# Altium project NodeSensor.PrjPcb
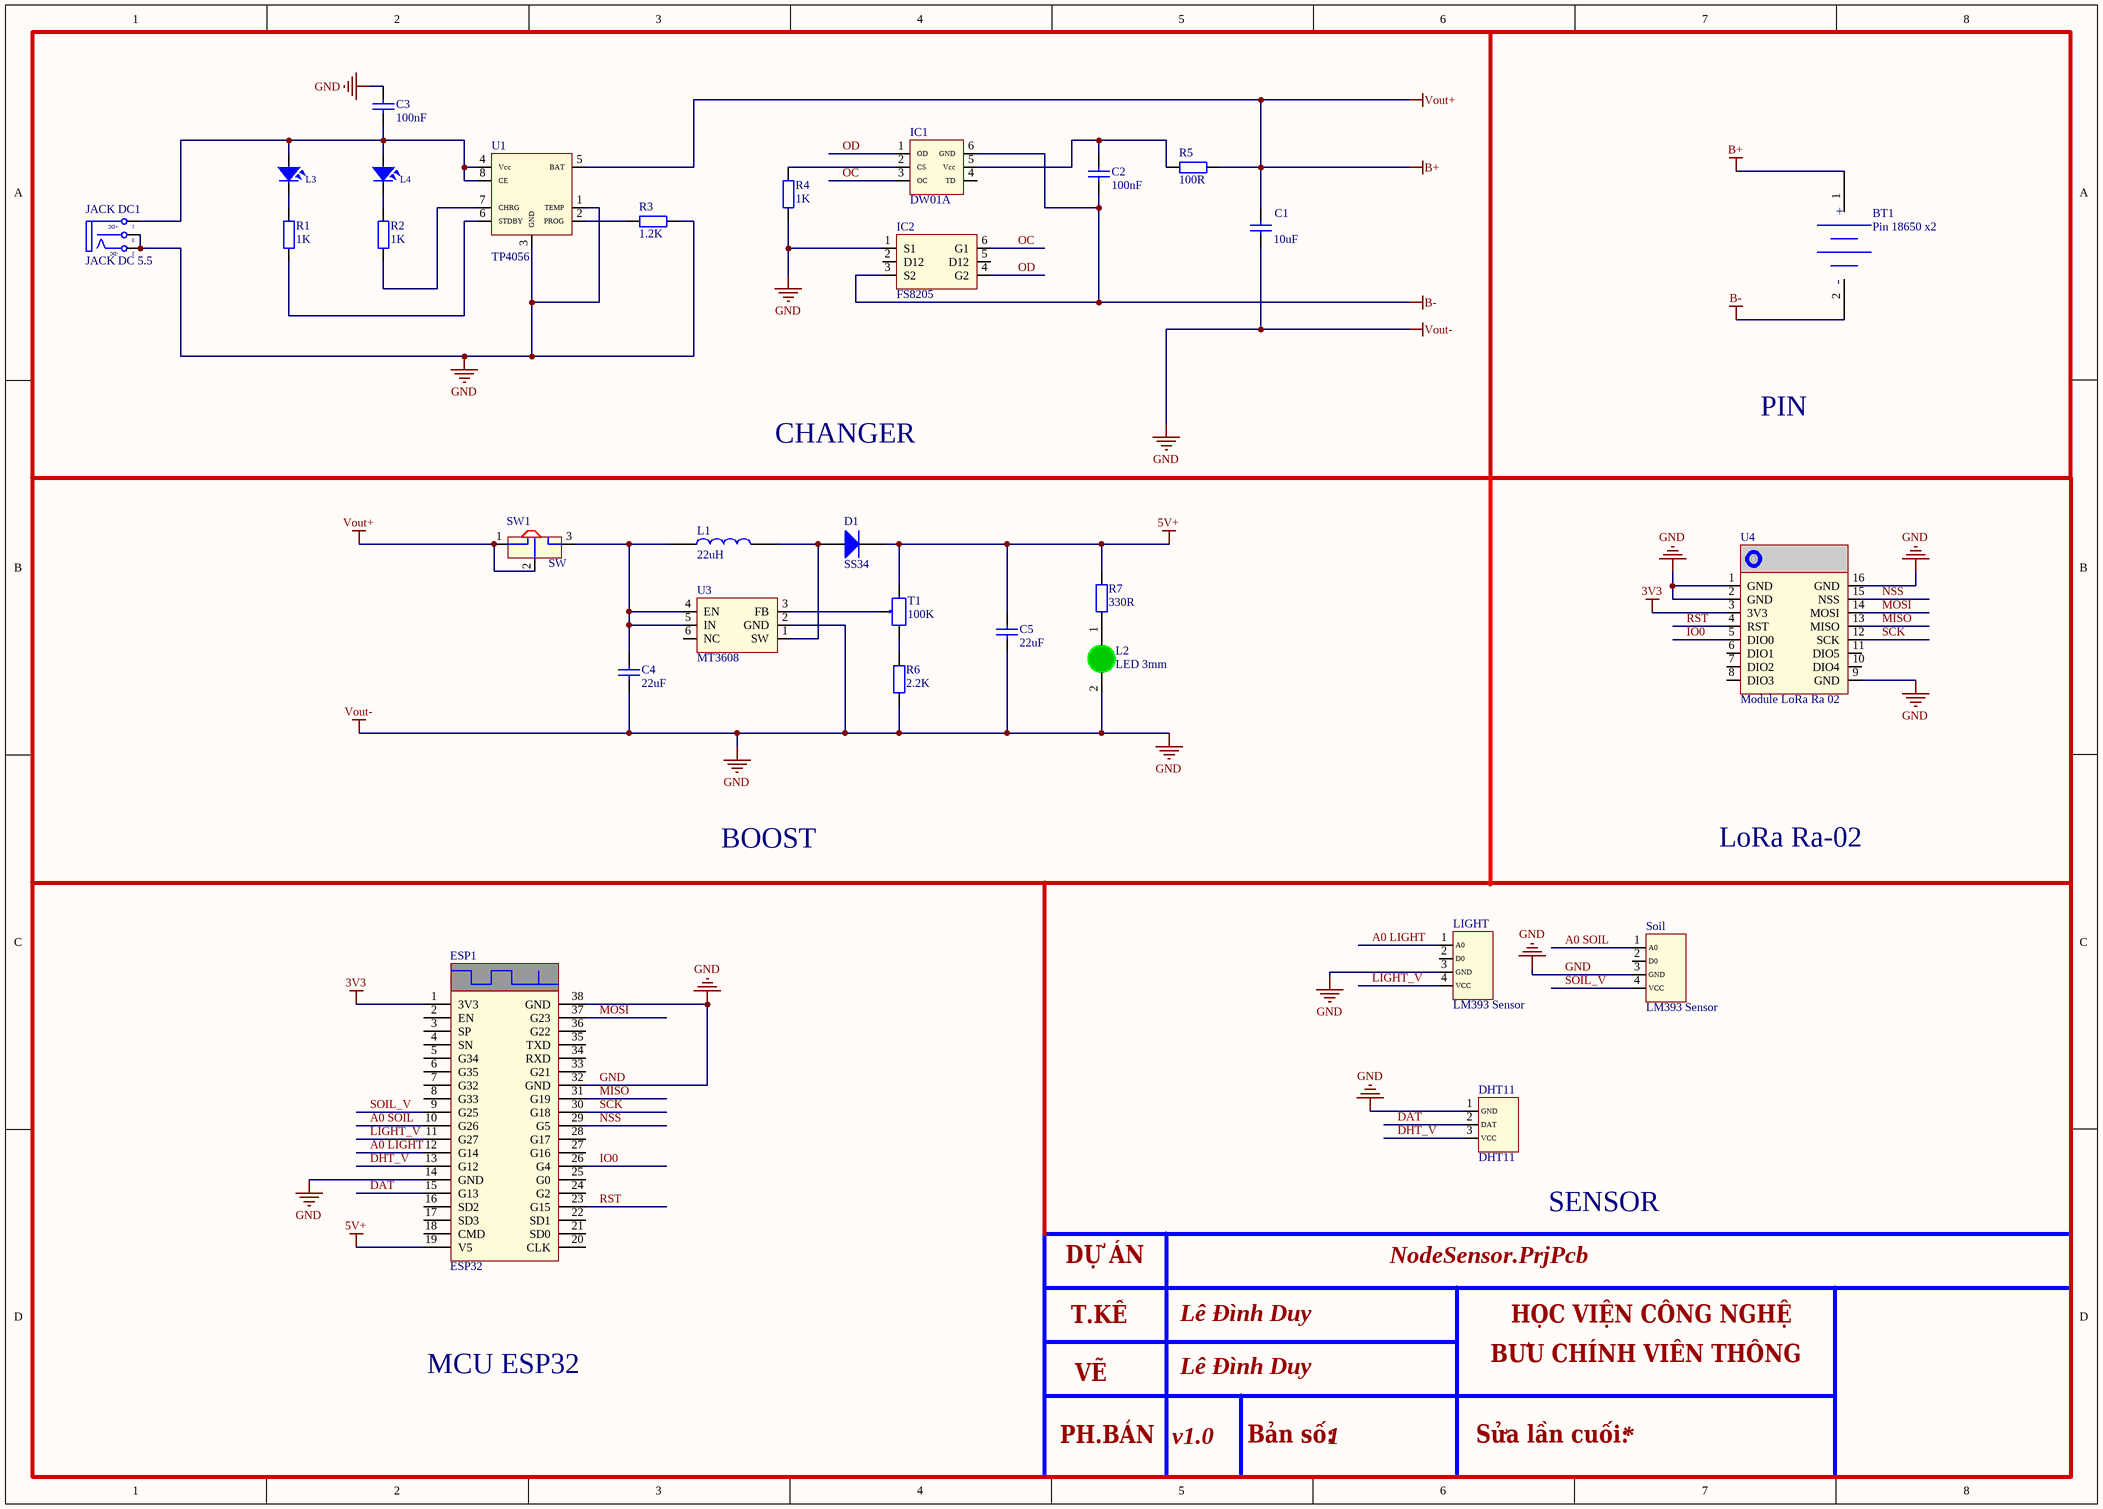
[diagram p0: NodeSensor.SchDoc]
1 sheet, 30 parts. Net scope: global (net labels, ports and power ports of the same name join across sheets).
Board file: NodeSensor2.1.PcbDoc

## Sheet NodeSensor.SchDoc
size A3; Author: Lê Đình Duy; DrawnBy: Lê Đình Duy; Revision: v1.0; SheetNumber: 1; SheetTotal: 1

### Parts
BT1  Pin 18650 x2  [De Pin 18650 x2]
C1  10uF  [tu 0805]
C2  100nF  [tu 0805]
C3  100nF  [tu 0805]
C4  22uF  [tu 1206]
C5  22uF  [tu 1206]
D1  SS34  [DIODE SMA]
DHT11  DHT11  [DHT11 Module]
ESP1  ESP32  [ESP32 DEVKIT 38Pin]
IC1  DW01A  [DW01A]
IC2  FS8205  [FS8205]
JACK_DC1  JACK DC 5.5  [JACK DC 5.5]
L1  22uH  [Cuon Cam 7x7x5]
L2  LED 3mm  [LED-3MM-GREEN]
L3  LED SMD  [SM-LED-0805-Red]  (value not drawn)
L4  LED SMD  [SM-LED-0805-Red]  (value not drawn)
LIGHT  LM393 Sensor  [Soil /Light Sensor]
R1  1K  [tro smd 0805]
R2  1K  [tro smd 0805]
R3  1.2K  [tro smd 0805]
R4  1K  [tro smd 0805]
R5  100R  [tro smd 0805]
R6  2.2K  [tro smd 0805]
R7  330R  [tro smd 0805]
Soil  LM393 Sensor  [Soil /Light Sensor]
SW1  SW  [CONG TAC GAT 3 PIN NGANG]
T1  100K  [Bien Tro Vi Chinh Dung]
U1  TP4056  [TP4056]
U3  MT3608  [MT3608]
U4  Module LoRa Ra 02  [LoRa Ra 02 Module 2]

### Nets
3V3: ESP1.1(3V3) U4.3(3V3)
5V+: C5.1 D1.2(K) ESP1.19(V5) R7.1 T1.3
B+: BT1.1(+) C1.1 R5.2 SW1.1 SW1.2 U1.5(BAT)  [also labelled Vout+]
B-: BT1.2(-) C2.2 IC1.6(GND) IC2.3(S2)
GND: C1.2 C3.1 C4.2 C5.2 DHT11.1(GND) ESP1.14(GND) ESP1.32(GND) ESP1.38(GND) IC2.1(S1) JACK_DC1.2(TN) JACK_DC1.3(S) L2.2(K) LIGHT.3(GND) R3.2 R4.2 R6.2 Soil.3(GND) U1.1(TEMP) U1.3(GND) U3.2(GND) U4.1(GND) U4.2(GND) U4.9(GND) U4.16(GND)  [also labelled Vout-]
A0 LIGHT: ESP1.12(G14) LIGHT.1(A0)
A0 SOIL: ESP1.10(G26) Soil.1(A0)
DAT: DHT11.2(DAT) ESP1.15(G13)
DHT_V: DHT11.3(VCC) ESP1.13(G12)
IO0: ESP1.26(G4) U4.5(DIO0)
LIGHT_V: ESP1.11(G27) LIGHT.4(VCC)
MISO: ESP1.31(G19) U4.13(MISO)
MOSI: ESP1.37(G23) U4.14(MOSI)
NSS: ESP1.29(G5) U4.15(NSS)
OC: IC1.3(OC) IC2.6(G1)
OD: IC1.1(OD) IC2.4(G2)
RST: ESP1.23(G15) U4.4(RST)
SCK: ESP1.30(G18) U4.12(SCK)
SOIL_V: ESP1.9(G25) Soil.4(VCC)
NetC2_1: C2.1 IC1.5(Vcc) R5.1
NetC3_2: C3.2 JACK_DC1.1(T) L3.1 L4.1 U1.4(Vcc) U1.8(CE)
NetC4_1: C4.1 L1.1 SW1.3 U3.4(EN) U3.5(IN)
NetD1_1: D1.1(A) L1.2 U3.1(SW)
NetIC1_2: IC1.2(CS) R4.1
NetL2_1: L2.1(A) R7.2
NetL3_2: L3.2 R1.1
NetL4_2: L4.2 R2.1
NetR1_2: R1.2 U1.6(STDBY)
NetR2_2: R2.2 U1.7(CHRG)
NetR3_1: R3.1 U1.2(PROG)
NetR6_1: R6.1 T1.1
NetT1_2: T1.2 U3.3(FB)

Not connected (* = marked no-connect by the designer): ESP1 2(EN) 3(SP) 4(SN) 5(G34) 6(G35) 7(G32) 8(G33) 16(SD2) 17(SD3) 18(CMD) 20(CLK) 21(SD0) 22(SD1) 24(G2) 25(G0) 27(G16) 28(G17) 33(G21) 34(RXD) 35(TXD) 36(G22); IC1 4(TD); IC2 2(D12) 5(D12); LIGHT 2(D0); Soil 2(D0); U3 6(NC); U4 6(DIO1) 7(DIO2) 8(DIO3) 10(DIO4) 11(DIO5)

### Notes on the sheet
- CHANGER
- PIN
- BOOST
- LoRa Ra-02
- SENSOR
- MCU ESP32
- DỰ ÁN
- T.KẾ
- HỌC VIỆN CÔNG NGHỆ
- VẼ
- BƯU CHÍNH VIỄN THÔNG
- PH.BẢN
- Bản số:
- Sửa lần cuối:
- (in symbol JACK DC 5.5) +DC; -DC

### Library data of the parts
BT1 = De Pin 18650 x2
C1-C3 = Tu 0805 104 50V 10%: Dán; Don_Vi: Con; So_Chan: 2; Ten_Linh_Kien: Tụ 0805 104-100nF 10% 50V; Ma_Hang: MH004551; Chung_Loai: Dán; Kieu_Chan: *
C4 C5 = Tu 1206 226 16V 20%: Dán; Don_Vi: Con; So_Chan: 2; Ten_Linh_Kien: Tụ 1206 226-22uF 20% 16V; Ma_Hang: MH004546; Chung_Loai: Dán; Kieu_Chan: *
D1 = Diode SS34 ( 1N5822 ): Dán; Don_Vi: Con; Ma_Hang: MH002104; Ten_Linh_Kien: Diode SS34 3A 40V SMA ( 1N5822 SS34A); Kieu_Chan: *; Chung_Loai: Dán
DHT11 = DHT11 Module
ESP1 = ESP32 DEV KIT: Board
IC2 = FS8205: SOT23-6
JACK_DC1 = JACK DC 5.5: Value: Jac DC
L1 = CUON CAM 47uH SMD: Dán; Don_Vi: Con; Ma_Hang: MH004211; Ten_Linh_Kien: Cuộn Cảm 47uH 7x7x4MM CD74R; Ghi_Chu: *; Kieu_Chan: *; Chung_Loai: Dán
L2 = LED 3mm Xanh La: Cắm; Don_Vi: Con; Ma_Hang: MH001054; Ten_Linh_Kien: Led 3MM Phủ Xanh (10c); Ghi_Chu: *; Kieu_Chan: *; Chung_Loai: Cắm
L3 L4 = LED SMD 0805
LIGHT Soil = Light/Soil sensor
R1-R7 = Tro 0805 5% 1k: Dán; Don_Vi: Con; So_Chan: 2; Ten_Linh_Kien: Trở 0805 5% 1k; Ma_Hang: MH005234; Chung_Loai: Dán; Kieu_Chan: *
SW1 = CONG TAC GAT 3 PIN NGANG
T1 = Bien Tro Tinh Chinh 10K Dung: Cắm; Ma_Hang: MH003232; Ten_Linh_Kien: Biến Trở VR 103-10K 3296W; Don_Vi: Con; Kieu_Chan: *; Chung_Loai: Cắm; Ghi_Chu: *
U3 = MT3608: SMD
U4 = LoRa Ra 02 Module 2